# EAGLE design Motorboard (EAGLE 7.7.0)

## Sheet 1 of 6
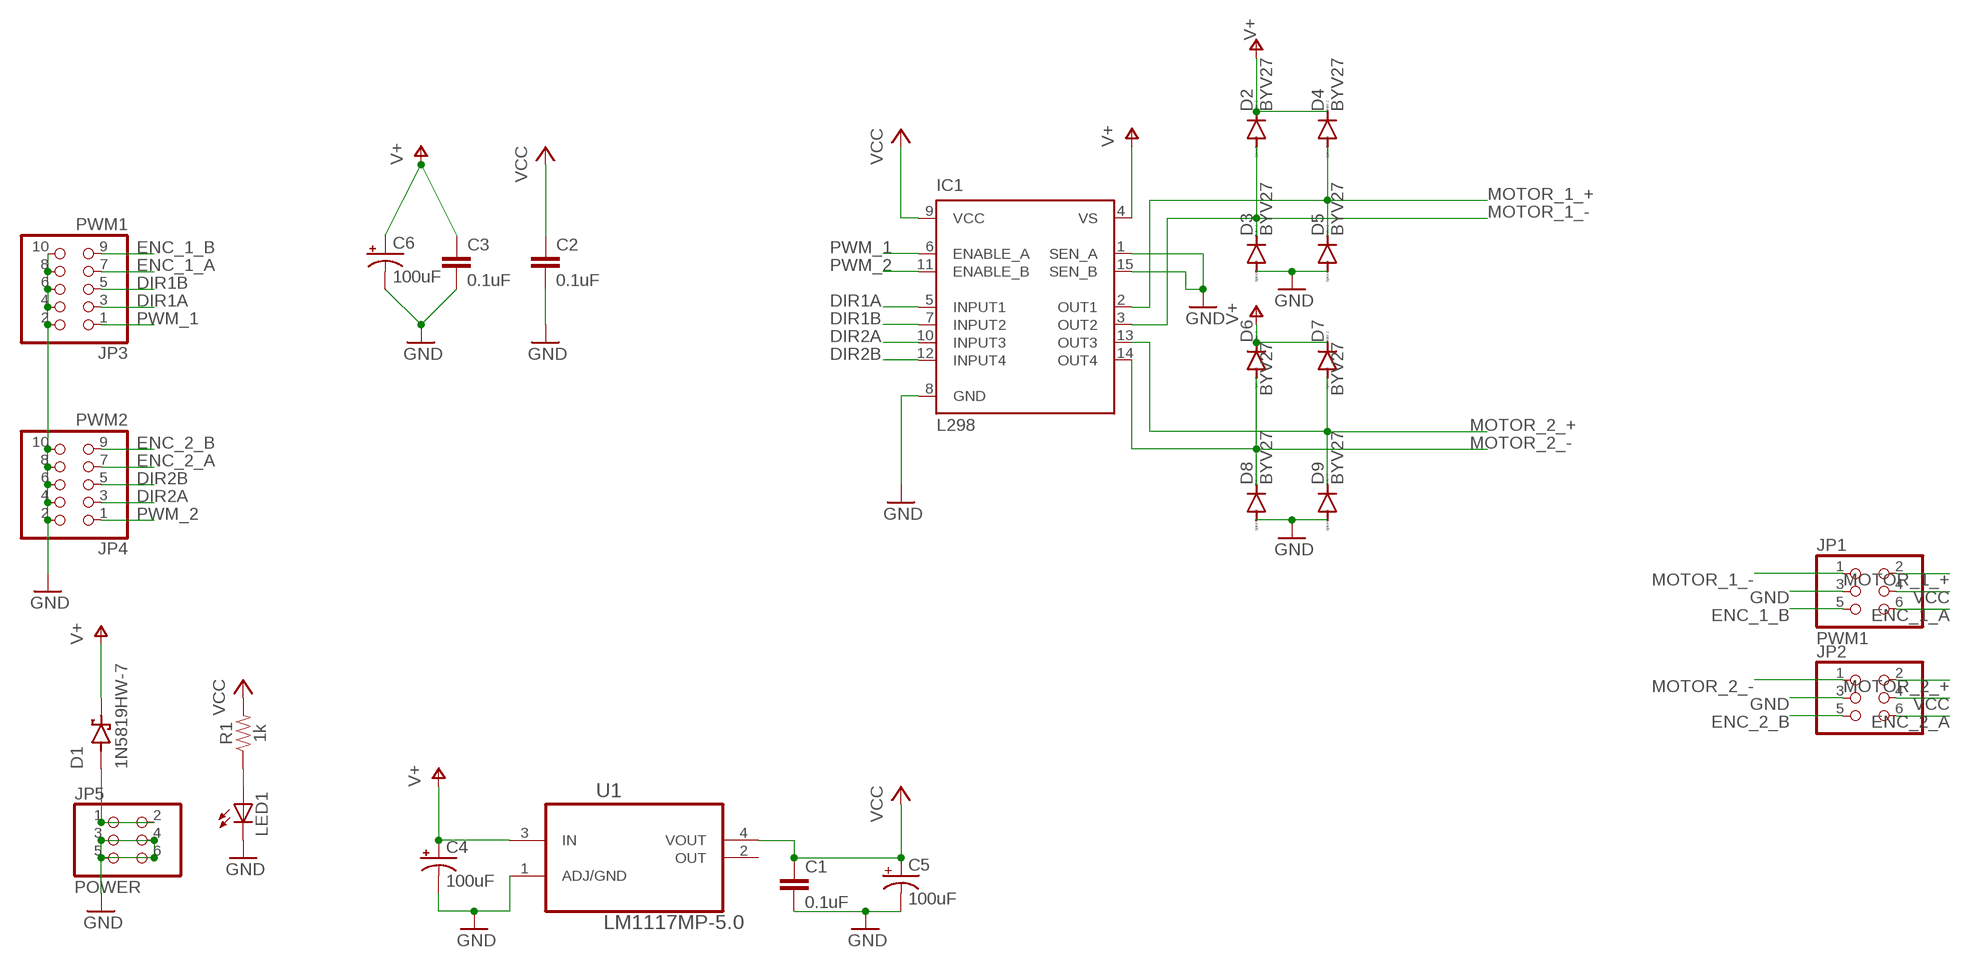
[diagram p0: schematic, sheet 1]

### Parts
C1  0.1uF  0.1UF-0603-25V-5%  [0603]
C2  0.1uF  0.1UF-0603-25V-5%  [0603]
C3  0.1uF  0.1UF-0603-25V-5%  [0603]
C4  100uF  100UF-POLAR-RADIAL-2.5MM-25V-20%  [CPOL-RADIAL-2.5MM-6.5MM]
C5  100uF  100UF-POLAR-RADIAL-2.5MM-25V-20%  [CPOL-RADIAL-2.5MM-6.5MM]
C6  100uF  100UF-POLAR-RADIAL-2.5MM-25V-20%  [CPOL-RADIAL-2.5MM-6.5MM]
D1  1N5819HW-7  [SOD3715X145N]
D2  BYV27  [SOD57-10]
D3  BYV27  [SOD57-10]
D4  BYV27  [SOD57-10]
D5  BYV27  [SOD57-10]
D6  BYV27  [SOD57-10]
D7  BYV27  [SOD57-10]
D8  BYV27  [SOD57-10]
D9  BYV27  [SOD57-10]
IC1  L298  [MULTIWATT-15]
JP1  PWM1  PINHD-2X3  [2X03]
JP2  PINHD-2X3  [2X03]
JP3  PWM1  PINHD-2X5  [2X05]
JP4  PWM2  PINHD-2X5  [2X05]
JP5  POWER  PINHD-2X3  [2X03]
LED1  LED3MM  [LED3MM]
R1  1k  1KOHM-0603-1/10W-1%  [0603]
U1  LM1117MP-5.0  [SOT230P696X180-4N]

### Nets
+5V: C1.1 C2.1 C5.1(+) IC1.9(VCC) R1.2 U1.4(VOUT) ; supply symbol labelled VCC
DIR1A: IC1.5(INPUT1) JP3.3
DIR1B: IC1.7(INPUT2) JP3.5
DIR2A: IC1.10(INPUT3) JP4.3
DIR2B: IC1.12(INPUT4) JP4.5
ENC_1_A: JP1.6 JP3.7
ENC_1_B: JP1.5 JP3.9
ENC_2_A: JP2.6 JP4.7
ENC_2_B: JP2.5 JP4.9
GND: C1.2 C2.2 C3.2 C4.2(-) C5.2(-) C6.2(-) D3.A D5.A D8.A D9.A IC1.1(SEN_A) IC1.8(GND) IC1.15(SEN_B) JP1.3 JP2.3 JP3.2 JP3.4 JP3.6 JP3.8 JP3.10 JP4.2 JP4.4 JP4.6 JP4.8 JP4.10 JP5.3 JP5.4 JP5.5 JP5.6 LED1.K(C) U1.1(ADJ/GND)
MOTOR_1_+: D4.A D5.C IC1.2(OUT1) JP1.2
MOTOR_1_-: D2.A D3.C IC1.3(OUT2) JP1.1
MOTOR_2_+: D7.A D9.C IC1.13(OUT3) JP2.2
MOTOR_2_-: D6.A D8.C IC1.14(OUT4) JP2.1
N$1: LED1.A R1.1
N$2: D1.A JP5.1 JP5.2
PWM_1: IC1.6(ENABLE_A) JP3.1
PWM_2: IC1.11(ENABLE_B) JP4.1
V+: C3.1 C4.1(+) C6.1(+) D1.C(K) D2.C D4.C D6.C D7.C IC1.4(VS) U1.3(IN)
VCC: JP1.4 JP2.4
Unconnected: U1.2(OUT)

## Sheet 2 of 6

## Sheet 3 of 6

## Sheet 4 of 6

## Sheet 5 of 6

## Sheet 6 of 6

## Library data of the parts
C1-C3 = SparkFun-Capacitors:0.1UF: 0.1µF ceramic capacitors A capacitor is a passive two-terminal electrical component used to store electrical energy temporarily in an electric field.; PROD_ID: CAP-08604
C4-C6 = SparkFun-Capacitors:100UF-POLAR: 100µF polarized capacitors A capacitor is a passive two-terminal electrical component used to store electrical energy temporarily in an electric field.; PROD_ID: CAP-08439
D1 = 1N5819HW-7:1N5819HW-7: 1N5819HW Series 40 V 1 A Surface Mount Schottky Barrier Rectifier - SOD-123 Check availability <https://pricing.snapeda.com/parts/1N5819HW-7/Diodes%20Inc./view-part?ref=eda>; AVAILABILITY: In Stock; DESCRIPTION: Diode Schottky 40 V 1A Surface Mount SOD-123; MF: Diodes Inc.; MP: 1N5819HW-7; PACKAGE: SOD-123 Fairchild Semiconductor; PRICE: None
D2-D9 = diode:BYV27: DIODE ultra fast
IC1 = st-microelectronics:L298: DUAL FULL-BRIDGE DRIVER; MPN: L298N; OC_FARNELL: 1589425; OC_NEWARK: 32M1527
JP1 JP2 JP5 = pinhead:PINHD-2X3: PIN HEADER
JP3 JP4 = pinhead:PINHD-2X5: PIN HEADER
LED1 = adafruit:LED: LED OSRAM: - CHIPLED LG R971, LG N971, LY N971, LG Q971, LY Q971, LO R971, LY R971 LH N974, LH R974 LS Q976, LO Q976, LY Q976 LO Q996 - Hyper CHIPLED LW Q18S LB Q993, LB Q99A, LB R99A - SideLED LS A670, LO A670, LY A670, LG A670, LP A670 LB A673, LV A673, LT A673, LW A673 LH A674 LY A675 LS A676, LA A676, LO A676, LY A676, LW A676 LS A679, LY A679, LG A679 - Hyper Micro SIDELED® LS Y876, LA Y876, LO Y876, LY Y876 LT Y87S - SmartLED LW L88C, LW L88S LB L89C, LB L89S, LG L890 LS L89K, LO L89K, LY L89K LS L896, LA L896, LO L896, LY L896 - TOPLED LS T670, LO T670, LY T670, LG T670, LP T670 LSG T670, LSP T670, LSY T670, LOP T670, LYG T670 LG T671, LOG T671, LSG T671 LB T673, LV T673, LT T673, LW T673 LH T674 LS T676, LA T676, LO T676, LY T676, LB T676, LH T676, LSB T676, LW T676 LB T67C, LV T67C, LT T67C, LS T67K, LO T67K, LY T67K, LW E67C LS E67B, LA E67B, LO E67B, LY E67B, LB E67C, LV E67C, LT E67C LW T67C LS T679, LY T679, LG T679 LS T770, LO T770, LY T770, LG T770, LP T770 LB T773, LV T773, LT T773, LW T773 LH T774 LS E675, LA E675, LY E675, LS T675 LS T776, LA T776, LO T776, LY T776, LB T776 LHGB T686 LT T68C, LB T68C - Hyper Mini TOPLED® LB M676 - Mini TOPLED Santana® LG M470 LS M47K, LO M47K, LY M47K Source: http://www.osram.convergy.de/
R1 = SparkFun-Resistors:1KOHM: 1kΩ resistor A resistor is a passive two-terminal electrical component that implements electrical resistance as a circuit element. Resistors act to reduce current flow, and, at the same time, act to lower voltage levels within circuits. - Wikipedia; PROD_ID: RES-07856
U1 = LM1117MP-5.0:LM1117MP-5.0: Linear regulators; AVAILABILITY: Unavailable; DESCRIPTION: Linear Voltage Regulator IC 1 Output 800mA SOT-223; MF: Texas Instruments; MP: LM1117MP-5.0; PACKAGE: SOT-223-4 Texas Instruments; PRICE: None

## Board
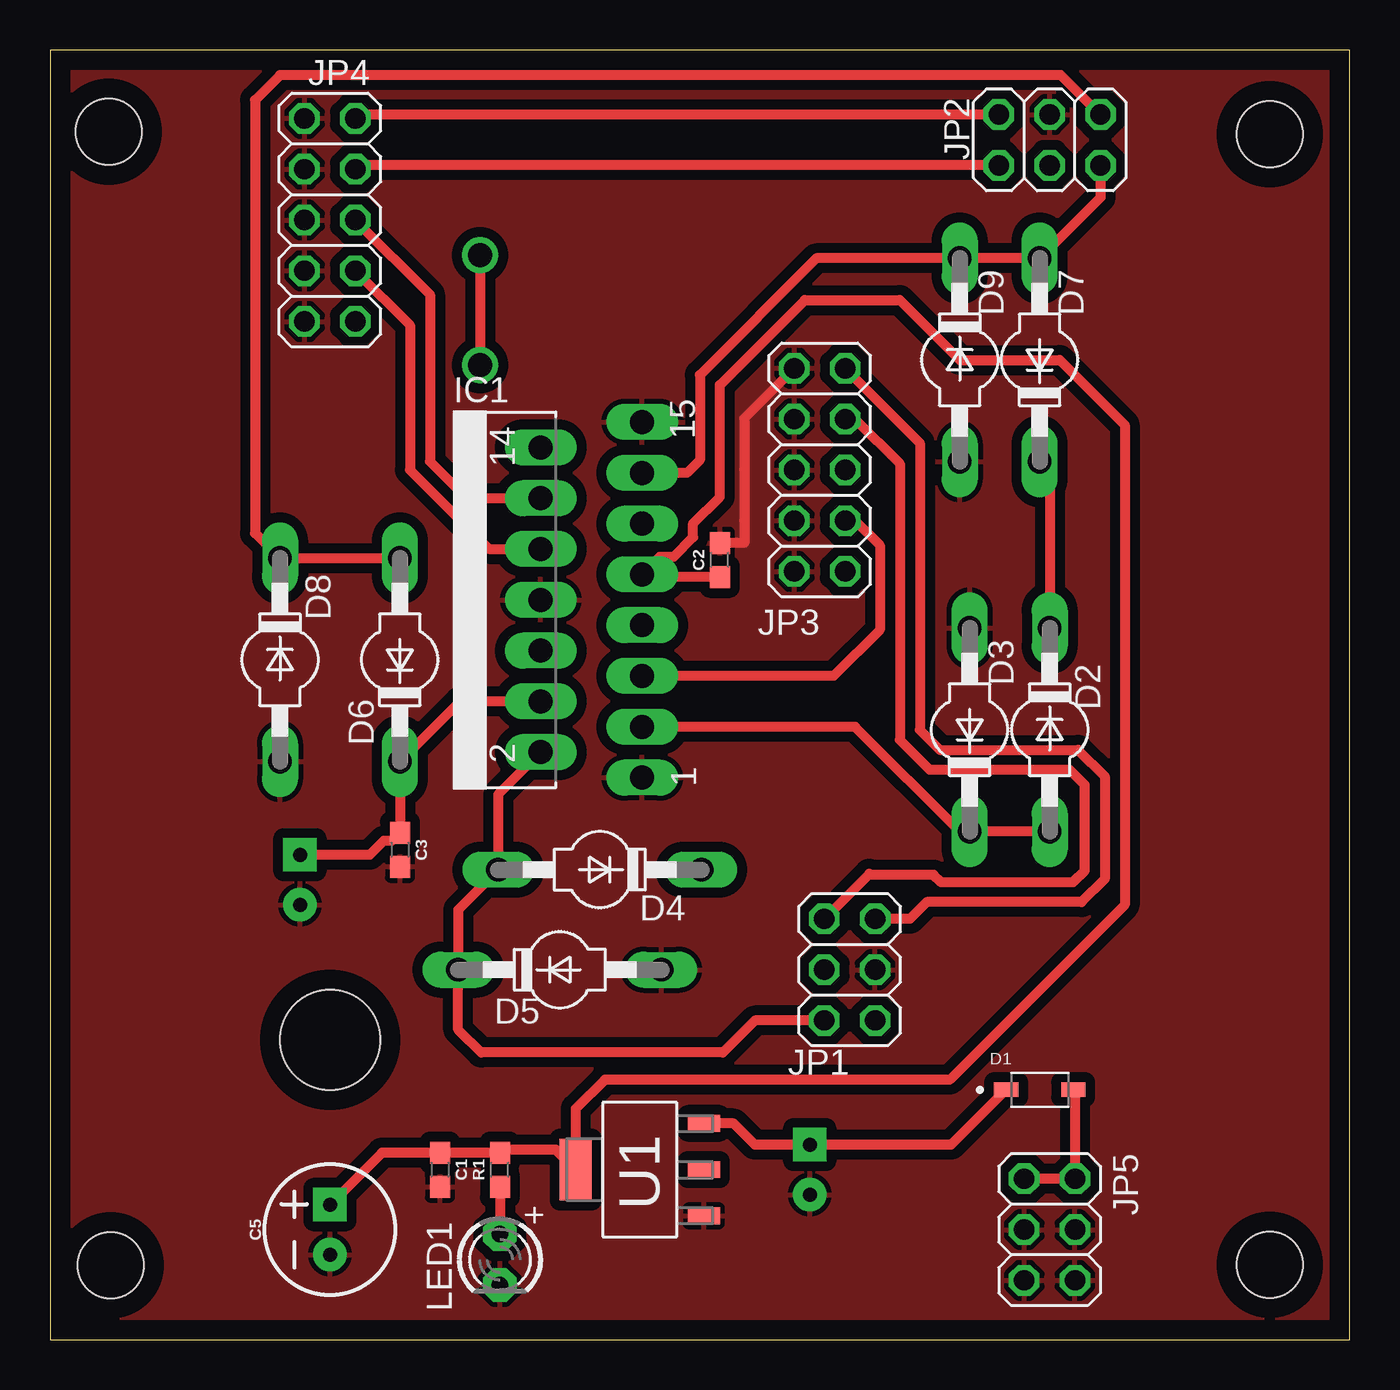
[diagram p1: board, top side]
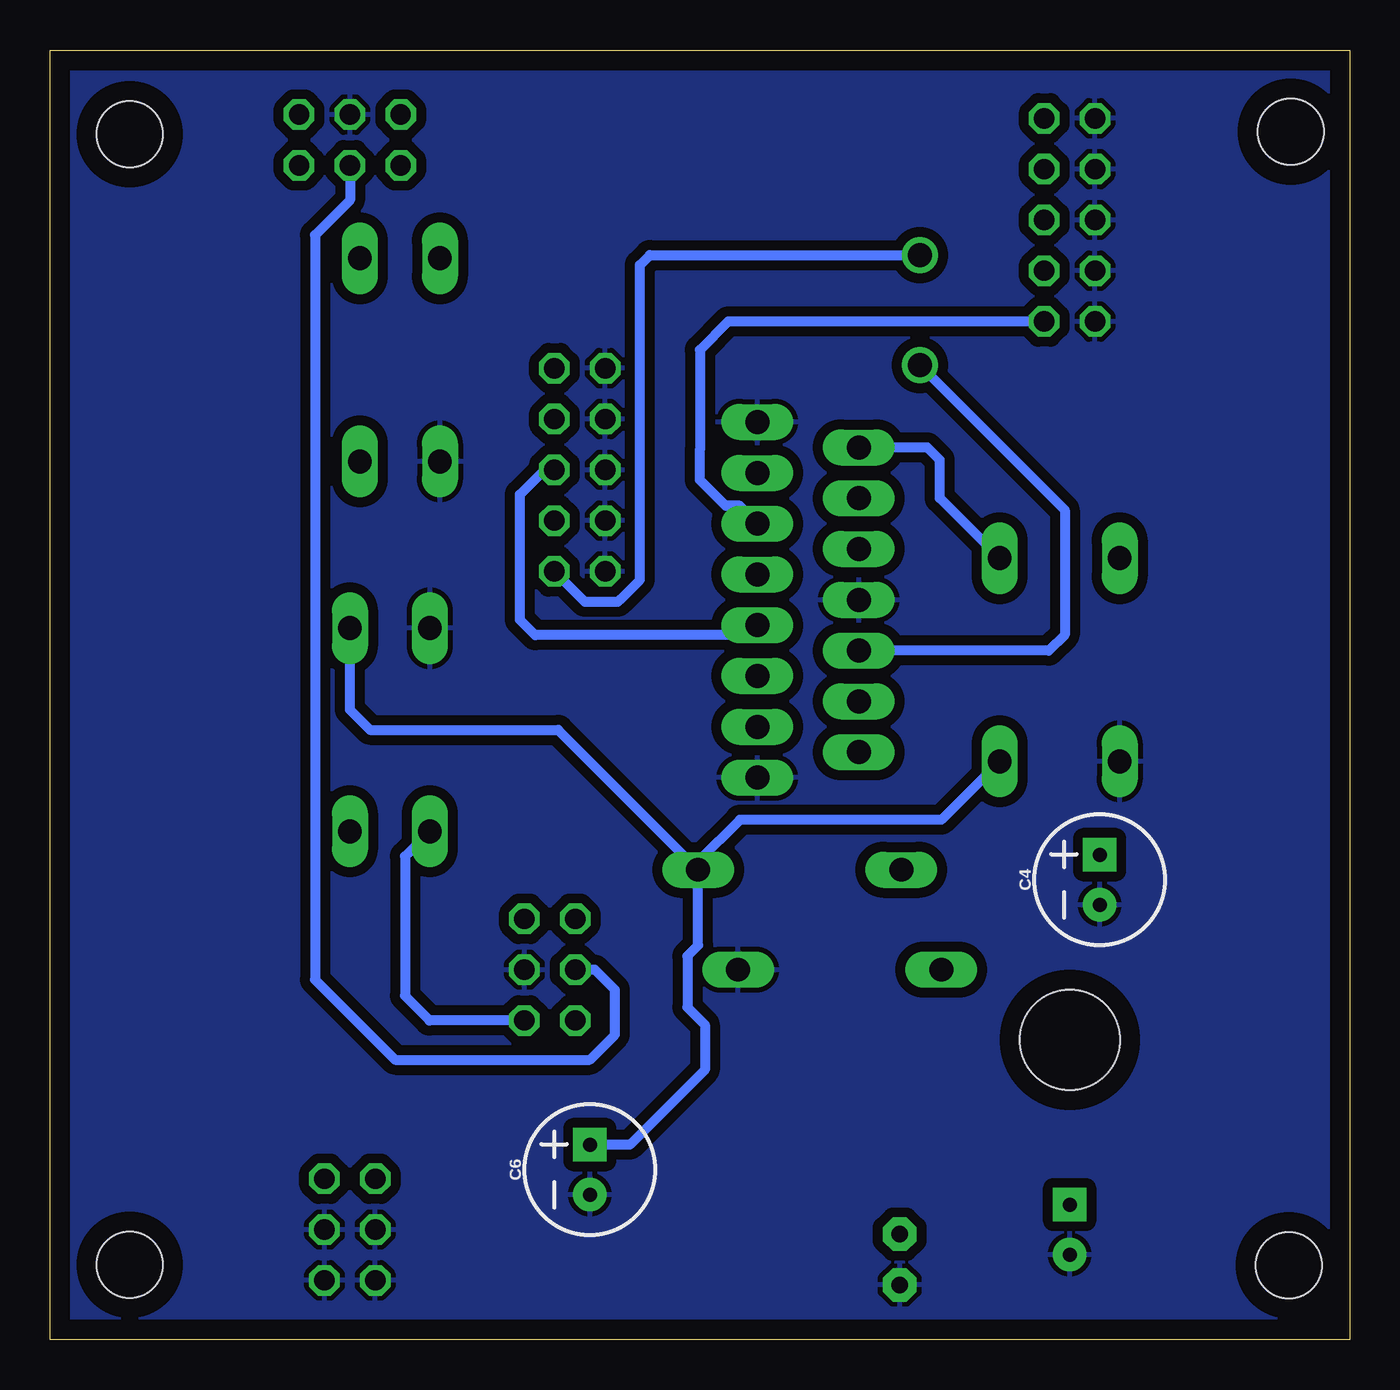
[diagram p2: board, bottom side, seen from below]

Size 65 x 64.5 mm. Coordinates in mm from the lower left corner, seen from the top.
Outline: 65,0 65,64.5 0,64.5 0,0 65,0
Copper layers (1*16): Top 0.035mm / dielectric 1.5mm / Bottom 0.035mm
Design rules "UWE_Router_Std_SS&DS": minimum track width 0.5mm, minimum drill 0.7mm, track to track 0.5mm, track to pad 0.5mm, pad to pad 0.5mm, via to via 0.5mm, smd to smd 0.5mm, copper to edge 1mm, drill to drill 0.2mm, minimum pad ring 10mil, minimum via ring 8mil, stop-mask expansion 4mil, vias tented up to drill 0mil, thermal gap 0.25mm
Holes 5 mm at 14,15
Holes 3.3 mm at 61.02,3.73 2.95,60.41 61.02,60.3 3.04,3.7

### Footprints (pad centres in the part's own frame; a part is rotated, then mirrored left to right if it is on the bottom)
0603 = smd 1.1 x 1: 1 -0.85,0; 2 0.85,0
CPOL-RADIAL-2.5MM-6.5MM = drill 0.7 pad 1.651 square: 1 1.25,0 | drill 0.7 pad 1.651: 2 -1.25,0
SOD3715X145N = smd 1.21 x 0.73: A 1.68,0; C -1.68,0
SOD57-10 = drill 1.194 long: A 5.08,0; C -5.08,0
MULTIWATT-15 = drill 1.2 long: 1 -8.89,-7.62; 2 -7.62,-2.54; 3 -6.35,-7.62; 4 -5.08,-2.54; 5 -3.81,-7.62; 6 -2.54,-2.54; 7 -1.27,-7.62; 8 0,-2.54; 9 1.27,-7.62; 10 2.54,-2.54; 11 3.81,-7.62; 12 5.08,-2.54; 13 6.35,-7.62; 14 7.62,-2.54; 15 8.89,-7.62
2X03 = drill 1.016 octagon: 1 -2.54,-1.27; 2 -2.54,1.27; 3 0,-1.27; 4 0,1.27; 5 2.54,-1.27; 6 2.54,1.27
2X05 = drill 1.016 octagon: 1 -5.08,-1.27; 2 -5.08,1.27; 3 -2.54,-1.27; 4 -2.54,1.27; 5 0,-1.27; 6 0,1.27; 7 2.54,-1.27; 8 2.54,1.27; 9 5.08,-1.27; 10 5.08,1.27
LED3MM = drill 0.813 pad 1.676 octagon: A -1.27,0; K 1.27,0
SOT230P696X180-4N = smd 1.6 x 0.838: 1 -3.2,2.311; 2 -3.2,0; 3 -3.2,-2.311 | smd 1.6 x 3.099: 4 3.2,0

### Placement (x,y rotation side)
C1  19.5,8.5 270 top
C2  33.5,39 90 top
C3  17.5,24.5 270 top
C4  12.5,23 90 bottom
C5  14,5.5 90 top
C6  38,8.5 90 bottom
D1  49.5,12.5 0 top
D2  50,30.5 270 top
D3  46,30.5 90 top
D4  27.5,23.5 180 top
D5  25.5,18.5 0 top
D6  17.5,34 90 top
D7  49.5,49 90 top
D8  11.5,34 270 top
D9  45.5,49 270 top
IC1  22,37 90 top
JP1  40,18.5 90 top
JP2  50,60 180 top
JP3  38.5,43.5 90 top
JP4  14,56 90 top
JP5  50,5.5 270 top
LED1  22.5,4 270 top
R1  22.5,8.5 90 top
U1  29.5,8.5 180 top

### Tracks (layer width: path | path; a pad name or v marks a point on that pad's centre or on a via)
+5V
  Top 0.5: C5.1 16.6,9.35 C1.1 R1.2 22.65,9.5 25.3,9.5 U1.4 26.3,11.55 27.75,13 45,13 53.75,21.75 53.75,45.75 50.5,49 45.5,49 42.5,52 37.75,52 33.5,47.75 33.5,42.15 32.17,40.82 32.17,40.13 31.2,39.16 30.51,39.16 IC1.9 29.74,38.15 C2.1
DIR1A
  Top 0.5: IC1.5 39.19,33.19 41.5,35.5 41.5,39.73 40.27,40.96 JP3.3
DIR1B
  Bottom 0.5: JP3.5 40.27,43.5 41.5,42.27 41.5,36 40.73,35.23 30.12,35.23 IC1.7
DIR2A
  Top 0.5: JP4.3 18,50.73 18,43.5 21.96,39.54 IC1.10
DIR2B
  Top 0.5: JP4.5 19,52.27 19,43.91 20.83,42.08 IC1.12
ENC_1_A
  Top 0.5: JP3.7 40.27,46.04 42.5,43.81 42.5,30 44,28.5 51,28.5 51.75,27.75 51.75,23.45 51.18,22.88 44.57,22.88 44.2,23.25 40.98,23.25 40.98,23.29 JP1.6
ENC_1_B
  Top 0.5: JP3.9 43.5,44.85 43.5,30.5 44.5,29.5 51.41,29.5 52.75,28.16 52.75,23.03 51.6,21.88 43.86,21.88 43.02,21.04 JP1.5
ENC_2_A
  Top 0.5: JP2.6 15.46,58.73 JP4.7
ENC_2_B
  Top 0.5: JP2.5 15.46,61.27 JP4.9
GND
  Top 0.5: JP3.10 35.96,47.31 34.73,46.08 34.73,46.04 34.73,43.54 34.73,43.5 34.73,41 34.73,40.96 34.73,40.92 34.73,39.85 C2.2
  pour Top: -1.5,68.75 -6.5,63.75 -6.5,-1.75 -1.5,-6.75 64.5,-6.75 69,-2.25 69,63.75 64,68.75
  pour Bottom: -0.5,68.75 -5.5,63.75 -5.5,-1.75 -0.5,-6.75 65.5,-6.75 70,-2.25 70,63.75 65,68.75
MOTOR_1_+
  Top 0.5: IC1.2 22.42,27.26 D4.A 20.42,21.5 D5.C 20.42,15.5 21.56,14.36 33.66,14.36 35.26,15.96 JP1.2
MOTOR_1_-
  Top 0.5: D2.A D3.C 45.5,25.42 40.27,30.65 IC1.3
  Bottom 0.5: JP1.1 46.02,15.96 47.25,17.19 47.25,24.17 D3.C
MOTOR_2_+
  Top 0.5: IC1.13 31.85,43.35 32.5,44 32.5,48.25 38.33,54.08 D9.C D7.A 52.54,57.12 JP2.2
MOTOR_2_-
  Top 0.5: JP2.1 50.56,63.25 11.5,63.25 10.25,62 10.25,40.33 D8.C D6.A
  Bottom 0.5: D6.A 20.5,42.08 20.5,44 21.12,44.62 IC1.14
N$1
  Top 0.5: R1.1 LED1.A
N$2
  Top 0.5: D1.A 51.27,12.41 JP5.2 JP5.1
PWM_1  (via drill 1.2)
  Top 0.5: v21.5,54.25 v21.5,48.75
  Bottom 0.5: JP3.1 38.26,36.91 36.6,36.91 36.51,37 36.5,37 35.5,38 35.5,52 35.5,53.75 35,54.25 v21.5,54.25 | v21.5,48.75 14.25,41.5 14.25,35.25 15.04,34.46 IC1.6
PWM_2
  Bottom 0.5: IC1.11 30.51,41.7 31.2,41.7 32.5,43 32.5,44.5 32.5,49.5 31.08,50.92 JP4.1
V+
  Top 0.5: D1.C 45.07,9.75 C6.1 35.25,9.75 34.19,10.81 U1.3 | D7.C 50,43.42 D2.C | IC1.4 20.5,31.92 D6.C C3.1 17.1,24.95 16.69,24.95 15.99,24.25 C4.1
  Bottom 0.5: D2.C 50,31.5 49,30.5 39.58,30.5 D4.C | D6.C 20.42,26 30.5,26 32.58,23.92 D4.C | C6.1 36,9.75 32.25,13.5 32.25,15.75 33.12,16.62 33.12,19.18 32.58,19.72 D4.C
VCC
  Bottom 0.5: JP2.4 50,57 51.75,55.25 51.75,18 47.75,14 38,14 36.75,15.25 36.75,17.5 37.75,18.5 JP1.4

### Text on the board
tStop: MODEST MICE MOTOR DRIVER V0.1